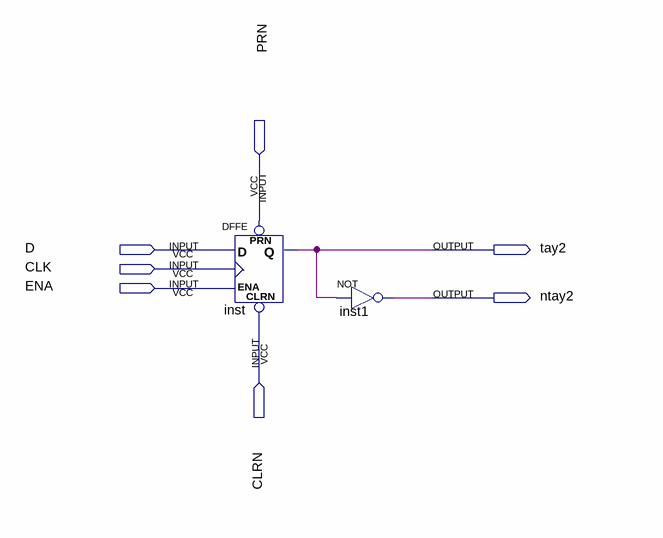
[diagram p0: schematic sheet]
// Quartus schematic dtrig.bdf as structural Verilog: 2 symbols, 7 pins
module dtrig (
  input  PRN,
  input  D,
  input  CLK,
  input  ENA,
  input  CLRN,
  output tay2,
  output ntay2
);

  DFFE inst (.PRN(PRN), .CLRN(CLRN), .D(D), .CLK(CLK), .ENA(ENA), .Q(tay2));
  not inst1 (ntay2, tay2);
endmodule
